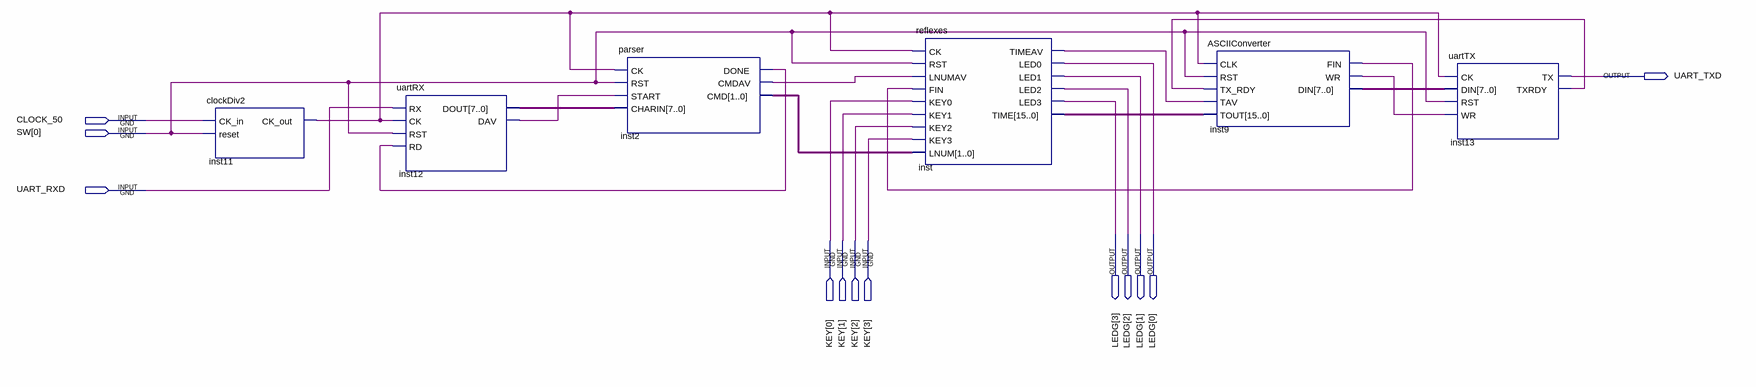
[diagram p0: schematic sheet]
// Quartus schematic total_test_DE2.bdf as structural Verilog: 6 symbols, 12 pins
module total_test_DE2 (
  input  CLOCK_50,
  input  [0:0] SW,
  input  UART_RXD,
  input  [3:0] KEY,
  output UART_TXD,
  output [3:0] LEDG
);

  wire inst2_cmdav, inst2_done, inst9_fin, inst9_wr, inst11_ck_out, inst12_dav, inst13_txrdy, inst_timeav;
  wire [1:0] inst2_cmd;
  wire [7:0] inst9_din, inst12_dout;
  wire [15:0] inst_time;

  clockDiv2 inst11 (.CK_in(CLOCK_50), .reset(SW[0]), .CK_out(inst11_ck_out));
  uartRX inst12 (.RX(UART_RXD), .CK(inst11_ck_out), .RST(SW[0]), .RD(inst2_done), .DOUT(inst12_dout), .DAV(inst12_dav));
  parser inst2 (
    .CK(inst11_ck_out), .RST(SW[0]), .START(inst12_dav), .CHARIN(inst12_dout), .DONE(inst2_done),
    .CMDAV(inst2_cmdav), .CMD(inst2_cmd));
  reflexes inst (
    .CK(inst11_ck_out), .RST(SW[0]), .LNUMAV(inst2_cmdav), .FIN(inst9_fin), .KEY0(KEY[0]), .KEY1(KEY[1]),
    .KEY2(KEY[2]), .KEY3(KEY[3]), .LNUM(inst2_cmd), .TIMEAV(inst_timeav), .LED0(LEDG[0]), .LED1(LEDG[1]),
    .LED2(LEDG[2]), .LED3(LEDG[3]), .TIME(inst_time));
  ASCIIConverter inst9 (
    .CLK(inst11_ck_out), .RST(SW[0]), .TX_RDY(inst13_txrdy), .TAV(inst_timeav), .TOUT(inst_time),
    .FIN(inst9_fin), .WR(inst9_wr), .DIN(inst9_din));
  uartTX inst13 (.CK(inst11_ck_out), .DIN(inst9_din), .RST(SW[0]), .WR(inst9_wr), .TX(UART_TXD), .TXRDY(inst13_txrdy));
endmodule
